# Altium project FMC_AWG_DAC_PSU.PrjPCB (part 2 of 2)
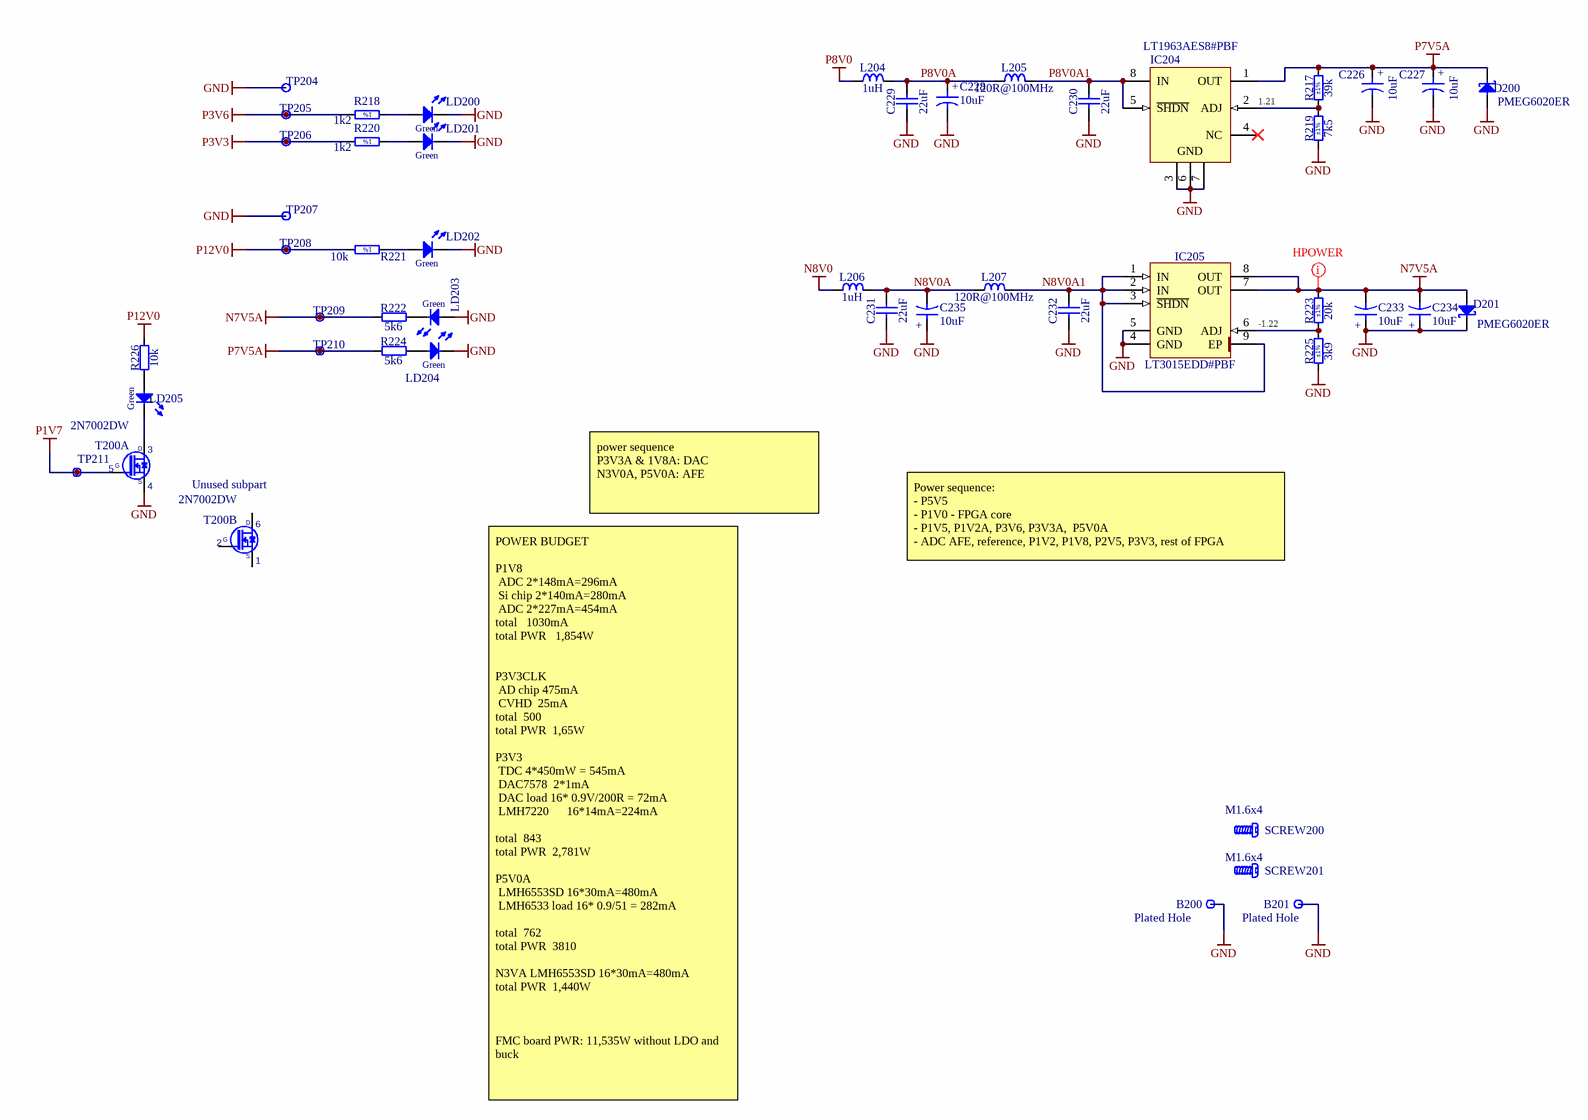
[diagram p2: FMC_AWG_DAC_PSU_LDO.SchDoc]

## Nets that join several sheets
GND: FMC_AWG_DAC_PSU (51 pins), FMC_AWG_DAC_PSU_LDO (29 pins)
N7V5A: FMC_AWG_DAC_PSU (J200.7 J200.8), FMC_AWG_DAC_PSU_LDO (8 pins)
N8V0: FMC_AWG_DAC_PSU (10 pins), FMC_AWG_DAC_PSU_LDO (L206.1)
P1V7: FMC_AWG_DAC_PSU (5 pins), FMC_AWG_DAC_PSU_LDO (T200.5 TP211.1)
P3V3: FMC_AWG_DAC_PSU (8 pins), FMC_AWG_DAC_PSU_LDO (R220.2 TP206.1)
P3V6: FMC_AWG_DAC_PSU (8 pins), FMC_AWG_DAC_PSU_LDO (R218.2 TP205.1)
P7V5A: FMC_AWG_DAC_PSU (J200.29 J200.30), FMC_AWG_DAC_PSU_LDO (7 pins)
P8V0: FMC_AWG_DAC_PSU (6 pins), FMC_AWG_DAC_PSU_LDO (L204.1)
P12V0: FMC_AWG_DAC_PSU (15 pins), FMC_AWG_DAC_PSU_LDO (R221.2 R226.2 TP208.1)

## Assembly variants
Standard: not fitted R211